# EasyEDA Pro project candlelight.eprj

# Schematic candelight
Create Date: 2022-07-31; Page Name: candelight; Project Name: candlelight; Schematic Name: candelight; Update Date: 2022-08-02
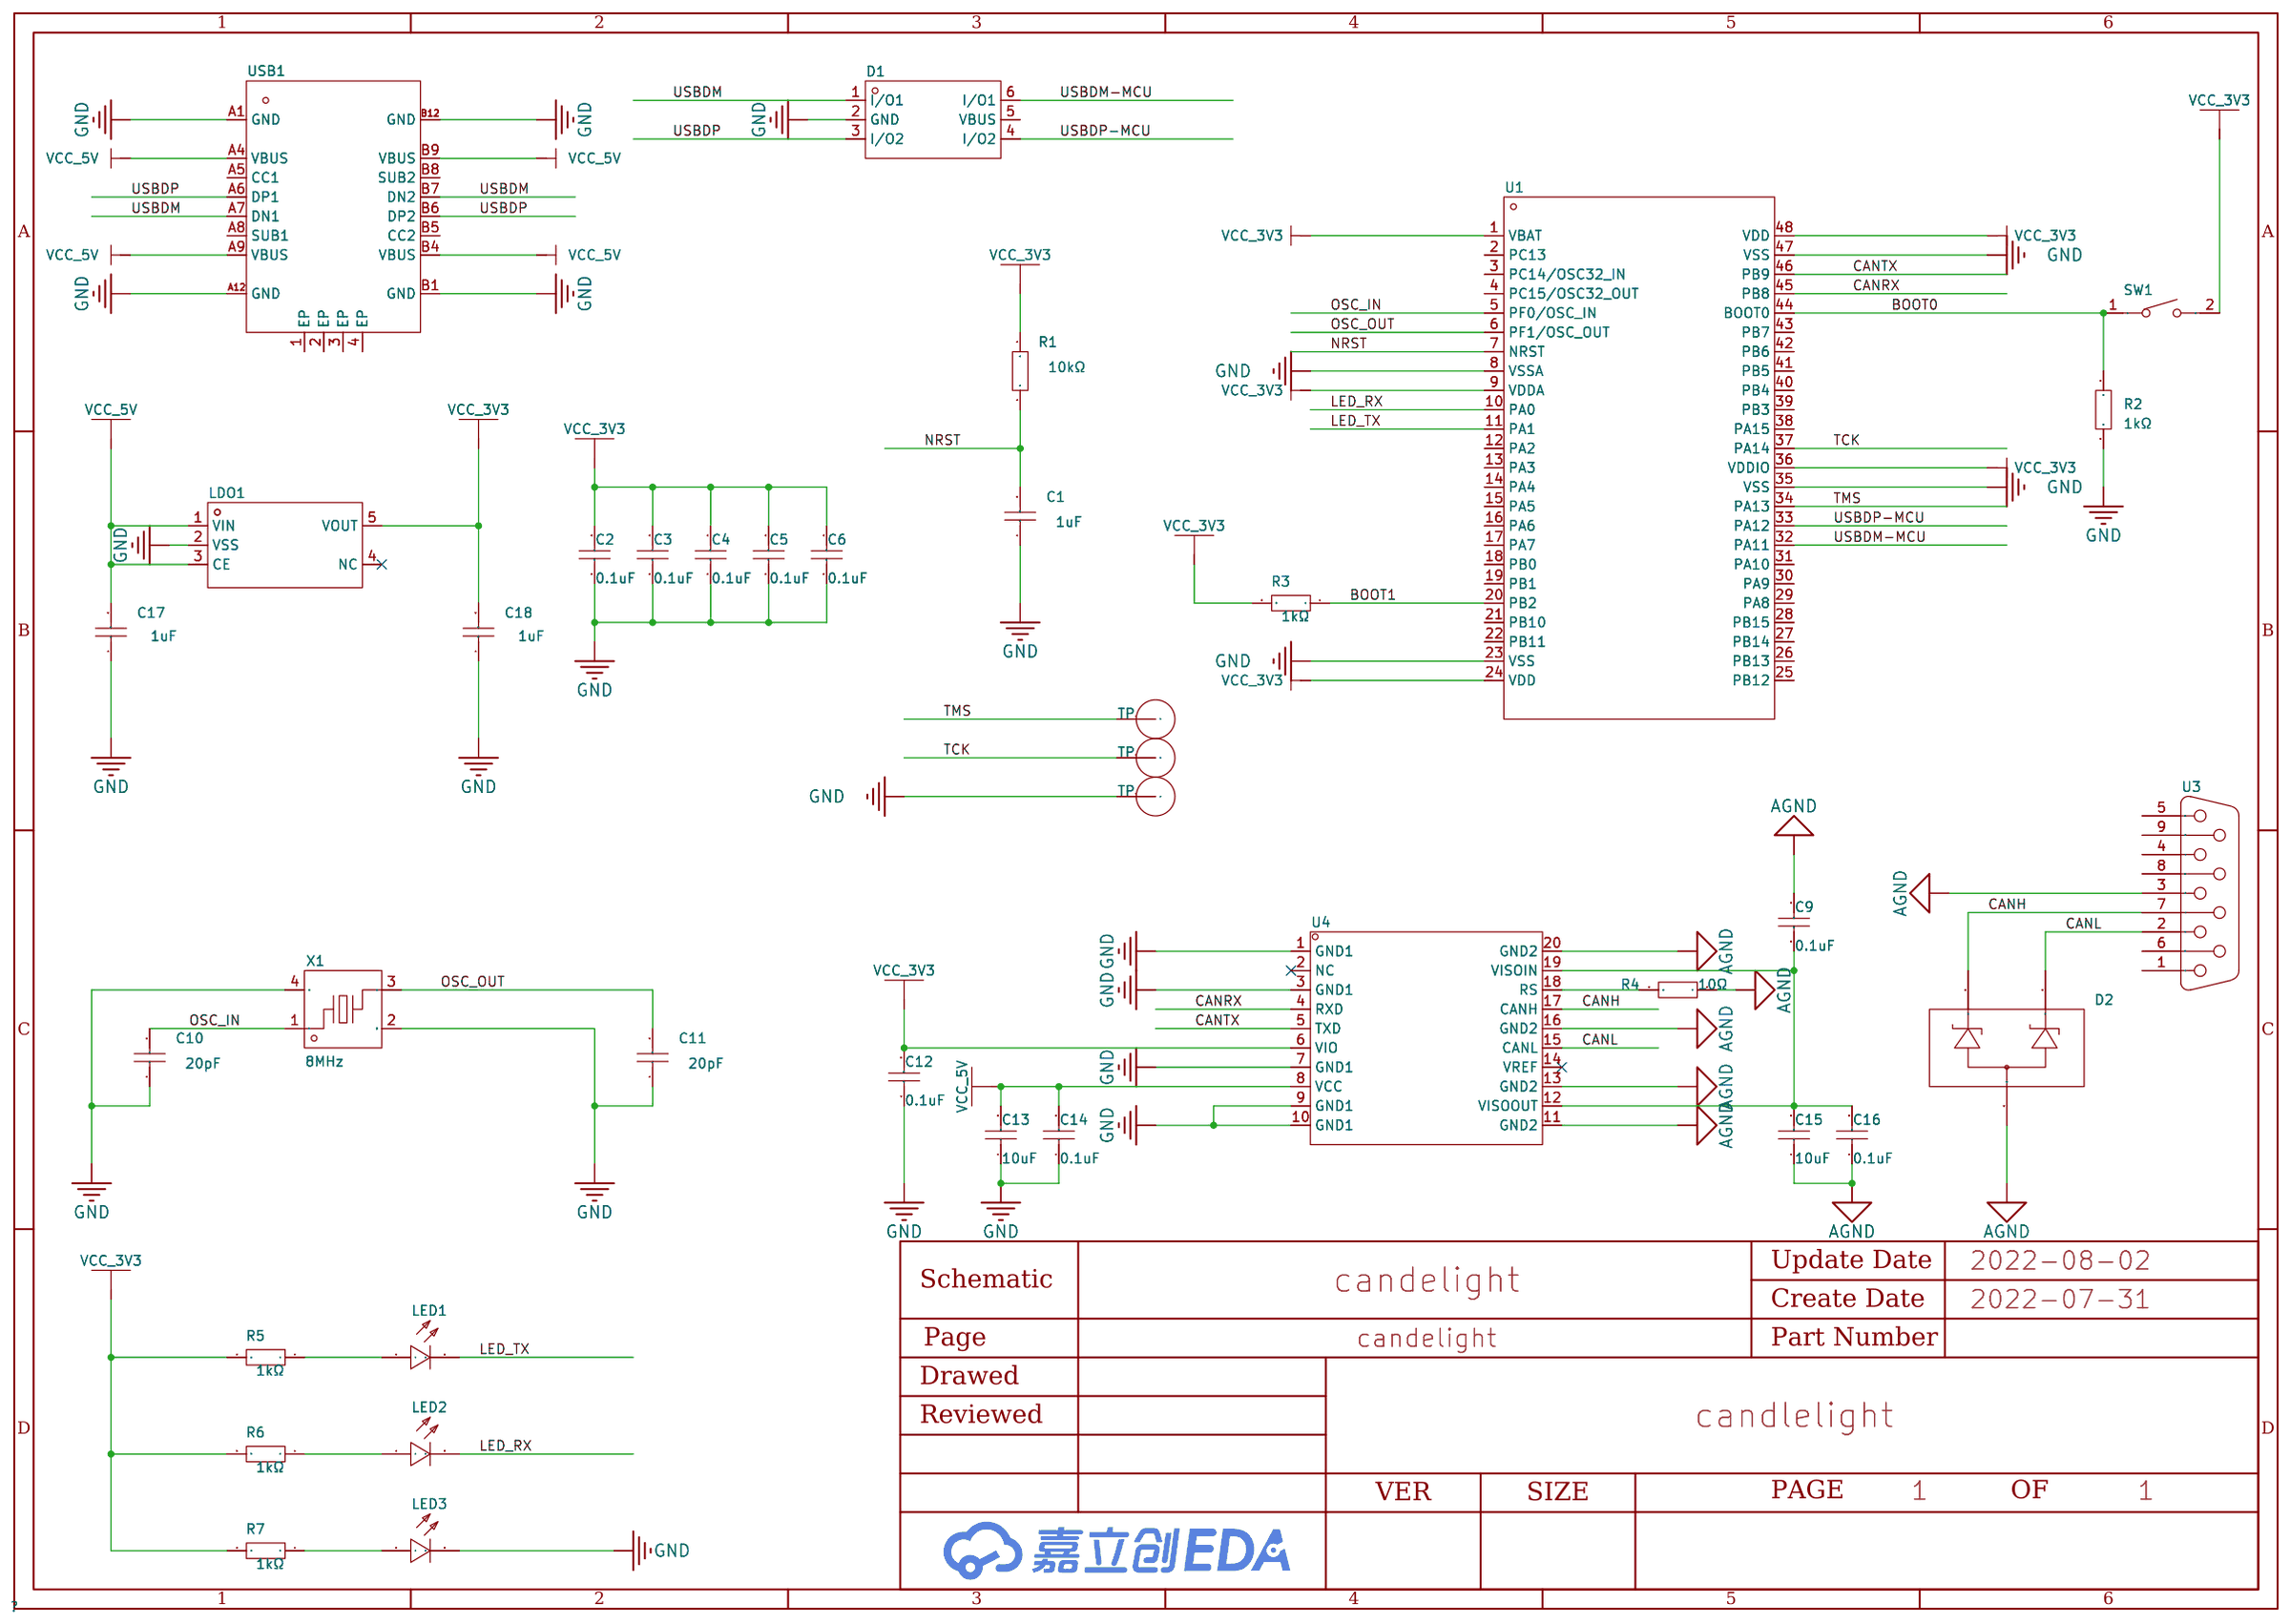
[diagram p0: schematic sheet]

## Parts
C1  1uF  [C0603]
C2  0.1uF  [C0603]
C3  0.1uF  [C0603]
C4  0.1uF  [C0603]
C5  0.1uF  [C0603]
C6  0.1uF  [C0603]
C9  0.1uF  [C0603]
C10  20pF  [C0603]
C11  20pF  [C0603]
C12  0.1uF  [C0603]
C13  10uF  [C0805]
C14  0.1uF  [C0603]
C15  10uF  [C0805]
C16  0.1uF  [C0603]
C17  1uF  [C0805]
C18  1uF  [C0805]
D1  -  [SOT-23-6_L2.9-W1.6-P0.95-LS2.8-BL]
D2  -  [SOT-23-3_L3.0-W1.7-P0.95-LS2.9-BR]
LDO1  -  [SOT-23-5_L3.0-W1.7-P0.95-LS2.8-BR]
LED1  -  [LED0603-FD]
LED2  -  [LED0603-FD]
LED3  -  [LED0603-FD]
R1  10kΩ  [R0603]
R2  1kΩ  [R0603]
R3  1kΩ  [R0603]
R4  10Ω  [R0603]
R5  1kΩ  [R0603]
R6  1kΩ  [R0603]
R7  1kΩ  [R0603]
SW1  -  [SW-SMD_L4.0-W2.9-LS5.0]
TP  -  [TP]
TP#2  -  [TP]
TP#3  -  [TP]
U1  -  [LQFP-48_L7.0-W7.0-P0.50-LS9.0-BL]
U3  -  [DB9_180C]
U4  -  [SOIC-20_L13.0-W7.6-P1.27-LS10.3-BL]
USB1  -  [USB-C-SMD_KH-TYPE-C-16P]
X1  8MHz  [OSC-SMD_4P-L3.2-W2.5-BL]

## Library data of the parts
C1-C6 C9-C12 C14 C16 = CL10C200JB8NNNC: 容值:20pF;精度:±5%;额定电压:50V;温度系数:C0G;; LCSC Part Name: 20pF ±5% 50V; Supplier Part: C1648; Manufacturer: SAMSUNG(三星); Supplier Footprint: 0603; JLCPCB Part Class: Basic Part; Datasheet: https://atta.szlcsc.com/upload/public/pdf/source/20160103/1457707686863.pdf; Supplier: LCSC; Tolerance: ±5%; Voltage Rated: 50V; Temperature Coefficient: C0G
C13 C15 = CL21A106KAYNNNE: 容值:10uF;精度:±10%;额定电压:25V;温度系数:X5R;; LCSC Part Name: 10uF ±10% 25V; Supplier Part: C15850; Manufacturer: SAMSUNG(三星); Supplier Footprint: 0805; JLCPCB Part Class: Basic Part; Datasheet: https://atta.szlcsc.com/upload/public/pdf/source/20160103/1457707679302.pdf; Supplier: LCSC; Tolerance: ±10%; Voltage Rated: 25V; Temperature Coefficient: X5R
C17 C18 = CL21B105KBFNNNE: 容值:1uF;精度:±10%;额定电压:50V;温度系数:X7R;; LCSC Part Name: 1uF ±10% 50V; Supplier Part: C28323; Manufacturer: SAMSUNG(三星); Supplier Footprint: 0805; JLCPCB Part Class: Basic Part; Datasheet: https://atta.szlcsc.com/upload/public/pdf/source/20160103/1457707718219.pdf; Supplier: LCSC; Tolerance: ±10%; Voltage Rated: 50V; Temperature Coefficient: X7R
D1 = USBLC6-2SC6: Supplier Part: C2687116; Manufacturer: UMW(友台半导体); Supplier Footprint: SOT23-6; JLCPCB Part Class: Extended Part; Datasheet: https://atta.szlcsc.com/upload/public/pdf/source/20210120/C2687116_72855D78BA38117EA699E100C421AF6D.pdf; Supplier: LCSC
D2 = ESDA6V1L: 反向截止电压(Vrwm):5.25V;击穿电压(最小值):6.1V;; LCSC Part Name: 5.25V; Supplier Part: C24378; Manufacturer: ST(意法半导体); Supplier Footprint: SOT-23(SOT-23-3); JLCPCB Part Class: Extended Part; Datasheet: https://atta.szlcsc.com/upload/public/pdf/source/20140512/1457707064919.pdf; Supplier: LCSC; Reverse Stand-Off Voltage (Vrwm): 5.25V; Breakdown Voltage (Min): 6.1V
LDO1 = ME6211C33M5G-N: 输出类型:固定;输出极性:正;输出通道数:1;最大输入电压:6V;输出电压:3.3V;压差:260mV@(200mA);输出电流:500mA;电源纹波抑制比(PRSS):70dB@(1kHz),62dB@(10kHz);; LCSC Part Name: Vin=6V Vout=3.3V 500mA 70dB@(1kHz),62dB@(10kHz); Supplier Part: C82942; Manufacturer: MICRONE(南京微盟); Supplier Footprint: SOT-23-5; JLCPCB Part Class: Extended Part; Datasheet: https://atta.szlcsc.com/upload/public/pdf/source/20170918/C82942_1505727073070976520.pdf; Supplier: LCSC; Output Type: 固定; Output Polarity: 正; Number of Outputs: 1; Maximum Input Voltage: 6V; Output Voltage: 3.3V; Dropout Voltage: 260mV@(200mA); Output Current: 500mA; Power Supply Rejection Ratio (PRSS): 70dB@(1kHz),62dB@(10kHz)
LED1-LED3 = NCD0603R1: 发光颜色:红灯;; LCSC Part Name: 红灯; Supplier Part: C84263; Manufacturer: 国星光电; Supplier Footprint: 0603; JLCPCB Part Class: Extended Part; Datasheet: https://atta.szlcsc.com/upload/public/pdf/source/20200820/C84263_DABC6A75E58F576973B407FDBA283D60.pdf; Supplier: LCSC; Emitted Color: 红灯
R1-R3 R5-R7 = 0603WAF1002T5E: 电阻类型:厚膜电阻;阻值:10kΩ;精度:±1%;功率:1/10W;温度系数:±100ppm/;最大工作电压:75V;工作温度范围:-55~+155;; LCSC Part Name: 10kΩ ±1%; Supplier Part: C25804; Manufacturer: UNI-ROYAL(厚声); Supplier Footprint: 0603; JLCPCB Part Class: Basic Part; Datasheet: https://atta.szlcsc.com/upload/public/pdf/source/20200306/C422600_1E6D84923E4A46A82E41ADD87F860B5C.pdf; Supplier: LCSC; Type: 厚膜电阻; Tolerance: ±1%; Power(Watts): 1/10W; Temperature Coefficient: ±100ppm/; Overload Voltage (Max): 75V; Operating Temperature Range: -55~+155
R4 = 0603WAF100JT5E: 电阻类型:厚膜电阻;阻值:10Ω;精度:±1%;功率:1/10W;温度系数:±400ppm/;最大工作电压:75V;工作温度范围:-55~+155;; LCSC Part Name: 10Ω ±1% 1/10W; Supplier Part: C22859; Manufacturer: UNI-ROYAL(厚声); Supplier Footprint: 0603; JLCPCB Part Class: Basic Part; Datasheet: https://atta.szlcsc.com/upload/public/pdf/source/20200306/C422600_1E6D84923E4A46A82E41ADD87F860B5C.pdf; Supplier: LCSC; Type: 厚膜电阻; Tolerance: ±1%; Power(Watts): 1/10W; Temperature Coefficient: ±400ppm/; Overload Voltage (Max): 75V; Operating Temperature Range: -55~+155
SW1 = TS-1088-AR02016: 触点电流:50mA;额定电压(DC):12V;绝缘电阻:100MΩ;电路结构:单刀单掷;安装方式:立贴;按钮形状:圆形按钮;按钮/盖帽颜色:黑色;作用力:160gf@±50gf;机械寿命:100000;工作温度:-30~+80;引脚样式:SMD接片;开关长度:4mm;开关宽度:3mm;开关高度:2mm;带支架:否;; LCSC Part Name: 342.0 160gf 贴片无柱轻触开关; Supplier Part: C720477; Manufacturer: XUNPU(讯普); Supplier Footprint: SMD; JLCPCB Part Class: Extended Part; Datasheet: https://atta.szlcsc.com/upload/public/pdf/source/20200810/C720475_60D09DD6C54279ADDB2DC25100F1CC11.pdf; Supplier: LCSC; Contact Current: 50mA; Voltage Rating (DC): 12V; Insulation Resistance: 100MΩ; Circuit: 单刀单掷; Mounting Style: 立贴; Actuator Style: 圆形按钮; Actuator/Cap Color: 黑色; Operating Force: 160gf@±50gf; Mechanical Life: 100000; Operating Temperature: -30~+80; Pin Style: SMD接片; Switch Length: 4mm; Switch Width: 3mm; Switch Height: 2mm; Strike Gundam: 否
TP TP#2 TP#3 = TP
U1 = STM32F072CBT6: CPU内核:ARM® Cortex®-M0;工作电压:1.65V ~ 3.6V;; Supplier Part: C81720; Manufacturer: ST(意法半导体); Supplier Footprint: LQFP-48_7x7x05P; JLCPCB Part Class: Extended Part; Datasheet: https://atta.szlcsc.com/upload/public/pdf/source/20170428/1493376825827.pdf; Supplier: LCSC; Core Processor: ARM® Cortex®-M0; Voltage - Supply (Vcc/Vdd): 1.65V ~ 3.6V; RAM Size: 16KB; Number of I/O: 37; A/D: 10x12bit; D/A: 2x12bit; PWM: 6; UART/USART: 4 USART; I2C（SMBUS/PMBUS）: 2; USB Device: 1; CAN: 1; Features: I2S,HDMI CEC
U3 = DB9_180C: DB9直插跨板
U4 = ADM3053BRWZ-REEL7: 类型:收发器;协议类别:CAN总线;驱动器/接收器数:1/1;数据速率:1Mbps;; Supplier Part: C117821; Manufacturer: ADI(亚德诺)/LINEAR; Supplier Footprint: SOIC-20_300mil; JLCPCB Part Class: Extended Part; Datasheet: https://atta.szlcsc.com/upload/public/pdf/source/20170707/1499421567880.pdf; Supplier: LCSC; Type: 收发器; Protocol: CAN总线; Number of Drivers/Receivers: 1/1; Data Rate: 1Mbps; Supply Voltage: 3.3V, 5V
USB1 = KH-TYPE-C-16P: 连接器类型:Type-C;标准:-;公母:母座;触点数量:16;端口数量:1;安装方式:卧贴;额定电流 - 电源:3A;工作温度范围:-40~+85;; LCSC Part Name: Type-C 母座 卧贴; Supplier Part: C709357; Manufacturer: kinghelm(金航标); Supplier Footprint: SMD; JLCPCB Part Class: Extended Part; Datasheet: https://atta.szlcsc.com/upload/public/pdf/source/20200911/C709357_AA8DCEB38BB20E3035A7ED7AE7667837.pdf; Supplier: LCSC; Connector Type: Type-C; Gender: 母座; Number of Contacts: 16; Number of Ports: 1; Mounting Style: 卧贴; Current Rating - Power (Max): 3A; Operating Temperature Range: -40~+85
X1 = X32258MOB4SI: 晶振类型:贴片无源晶振;频率:8MHz;频率公差:±10ppm;频率稳定度:±30ppm;负载电容:12pF;工作温度:-40~+85;; LCSC Part Name: YSX321SL 8MHz 12pF ±10ppm; Supplier Part: C2682775; Manufacturer: YXC扬兴科技; Supplier Footprint: SMD3225-4P; JLCPCB Part Class: Extended Part; Datasheet: https://atta.szlcsc.com/upload/public/pdf/source/20210106/C2682774_0CD4FDA5D9DA3FBEEC23BD607A48E4B0.pdf; Supplier: LCSC; Crystal Type: 贴片无源晶振; Frequency Tolerance: ±10ppm; Frequency Stability: ±30ppm; Load Capacitance: 12pF; Operating Temperature: -40~+85

## Nets
AGND: C9.2 C15.1 C16.1 D2.3 R4.1 U3.3 U4.11(GND2) U4.13(GND2) U4.16(GND2) U4.20(GND2)
GND: C1.1 C2.1 C3.1 C4.1 C5.1 C6.1 C10.1 C11.1 C12.1 C13.1 C14.1 C17.1 C18.1 D1.2(GND) LDO1.2(VSS) LED3.2(K) R2.2 TP#3.1 U1.8(VSSA) U1.23(VSS) U1.35(VSS) U1.47(VSS) U4.1(GND1) U4.3(GND1) U4.7(GND1) U4.9(GND1) U4.10(GND1) USB1.A1(GND) USB1.A12(GND) USB1.B1(GND) USB1.B12(GND) X1.2(GND) X1.4(GND)
VCC_3V3: C2.2 C3.2 C4.2 C5.2 C6.2 C12.2 C18.2 LDO1.5(VOUT) R1.2 R3.2 R5.2 R6.2 R7.2 SW1.2 U1.1(VBAT) U1.9(VDDA) U1.24(VDD) U1.36(VDDIO) U1.48(VDD) U4.6(VIO)
VCC_5V: C13.2 C14.2 C17.2 LDO1.1(VIN) LDO1.3(CE) U4.8(VCC) USB1.A4(VBUS) USB1.A9(VBUS) USB1.B4(VBUS) USB1.B9(VBUS)
BOOT0: R2.1 SW1.1 U1.44(BOOT0)
BOOT1: R3.1 U1.20(PB2)
CANH: D2.2 U3.7 U4.17(CANH)
CANL: D2.1 U3.2 U4.15(CANL)
CANRX: U1.45(PB8) U4.4(RXD)
CANTX: U1.46(PB9) U4.5(TXD)
LED_RX: LED2.2(K) U1.10(PA0)
LED_TX: LED1.2(K) U1.11(PA1)
NRST: C1.2 R1.1 U1.7(NRST)
OSC_IN: C10.2 U1.5(PF0/OSC_IN) X1.1
OSC_OUT: C11.2 U1.6(PF1/OSC_OUT) X1.3
TCK: TP.1 U1.37(PA14)
TMS: TP#2.1 U1.34(PA13)
USBDM: D1.1(I/O1) USB1.A7(DN1) USB1.B7(DN2)
USBDM-MCU: D1.6(I/O1) U1.32(PA11)
USBDP: D1.3(I/O2) USB1.A6(DP1) USB1.B6(DP2)
USBDP-MCU: D1.4(I/O2) U1.33(PA12)
$1N12268: R4.2 U4.18(RS)
$1N12385: C9.1 C15.2 C16.2 U4.12(VISOOUT) U4.19(VISOIN)
Net-(LED1-1): LED1.1(A) R5.1
Net-(LED2-1): LED2.1(A) R6.1
Net-(LED3-1): LED3.1(A) R7.1

Not connected (* = marked no-connect by the designer): D1 5(VBUS); LDO1 4(NC)*; U1 2(PC13) 3(PC14/OSC32_IN) 4(PC15/OSC32_OUT) 12(PA2) 13(PA3) 14(PA4) 15(PA5) 16(PA6) 17(PA7) 18(PB0) 19(PB1) 21(PB10) 22(PB11) 25(PB12) 26(PB13) 27(PB14) 28(PB15) 29(PA8) 30(PA9) 31(PA10) 38(PA15) 39(PB3) 40(PB4) 41(PB5) 42(PB6) 43(PB7); U3 1 4 5 6 8 9; U4 2(NC)* 14(VREF)*; USB1 1(EP) 2(EP) 3(EP) 4(EP) A5(CC1) A8(SUB1) B5(CC2) B8(SUB2)

# Board candelight
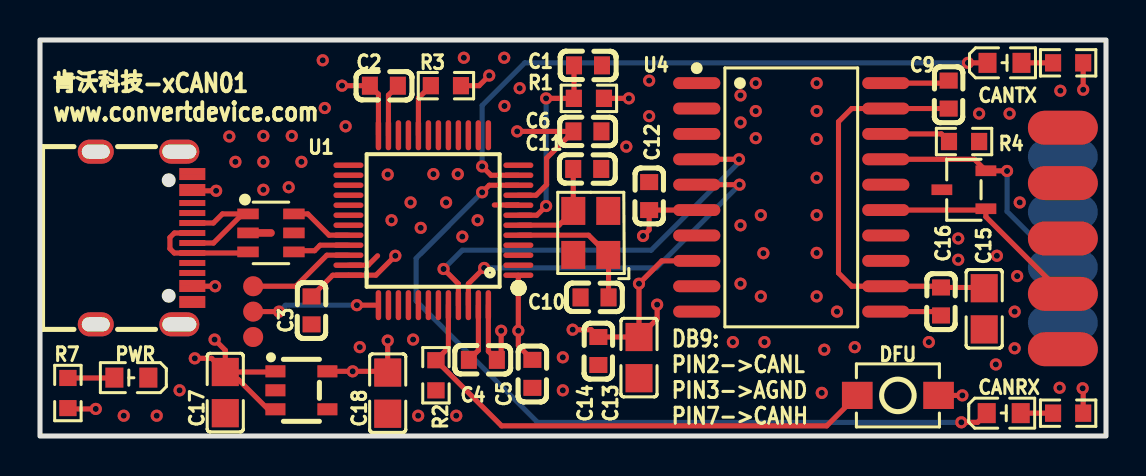
[diagram p1: board, top side]
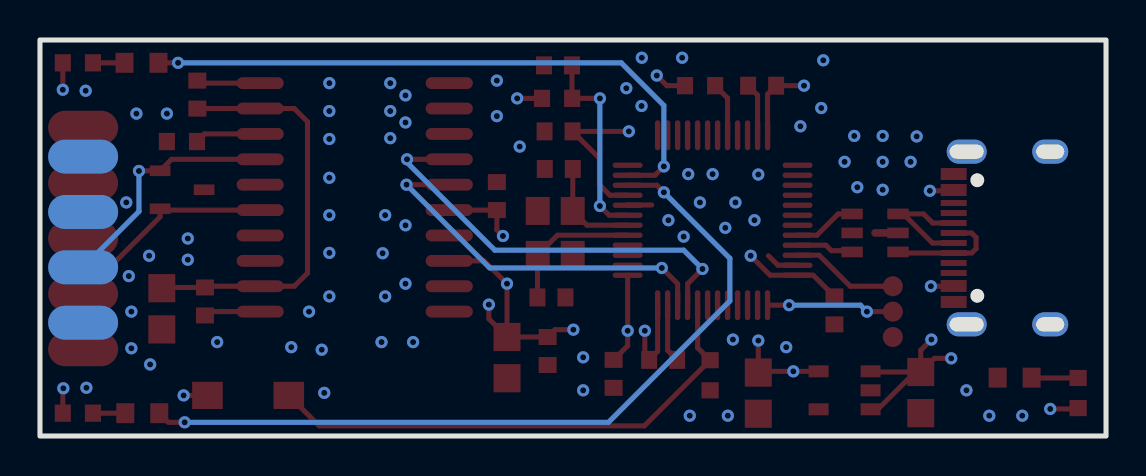
[diagram p2: board, bottom side, seen from below]

Outline 53.34 x 19.81 mm; copper layers: Top Layer, GND, POWER, Bottom Layer. Coordinates in mm from the lower left corner of the outline.
Outline path: rectangle 0,19.81 53.34,0
Stack: Top Layer 0.035mm / Dielectric1 0.48mm PP er 4.5 / GND 0.035mm / Dielectric2 0.48mm FR4 er 4.5 / POWER 0.035mm / Dielectric3 0.48mm PP er 4.5 / Bottom Layer 0.035mm

## Design rules (mm)
spacing safeClearance (default): track to track 0.152, other pairs 0.152 to 0.3
track width trackWidth (default): min 0.127, default 0.254, max 2.54
differential pair differentialPair (default): width min 0.127, default 0.254, max 2.54; gap min 0.152, default 0.152
via viaSize (default): diameter min 0.5, default 0.61, max 10; hole min 0.3, default 0.305, max 6

## Placement (name value [footprint] x y rotation side)
C1  1uF  [C0603]  27.42 18.54 180 top
C2  0.1uF  [C0603]  17.21 17.53 180 top
C3  0.1uF  [C0603]  13.59 6.29 90 top
C4  0.1uF  [C0603]  22.16 3.81 0 top
C5  0.1uF  [C0603]  24.64 3.11 90 top
C6  0.1uF  [C0603]  27.39 15.24 180 top
C9  0.1uF  [C0603]  45.47 17.08 90 top
C10  20pF  [C0603]  27.75 6.93 0 top
C11  20pF  [C0603]  27.38 13.36 180 top
C12  0.1uF  [C0603]  30.48 12 270 top
C13  10uF  [C0805]  29.97 3.92 90 top
C14  0.1uF  [C0603]  27.94 4.25 90 top
C15  10uF  [C0805]  47.24 6.36 90 top
C16  0.1uF  [C0603]  45.09 6.73 90 top
C17  1uF  [C0805]  9.27 2.17 90 top
C18  1uF  [C0805]  17.4 2.15 90 top
CANRX  -  [LED0603-FD]  48.22 1.14 180 top
CANTX  -  [LED0603-FD]  48.26 18.67 180 top
D1  -  [SOT-23-6_L2.9-W1.6-P0.95-LS2.8-BL]  11.56 10.16 270 top
D2  -  [SOT-23-3_L3.0-W1.7-P0.95-LS2.9-BR]  46.23 12.32 0 top
DFU  -  [SW-SMD_L4.0-W2.9-LS5.0]  42.93 2.03 0 top
LDO1  -  [SOT-23-5_L3.0-W1.7-P0.95-LS2.8-BR]  13.08 2.29 180 top
PWR  -  [LED0603-FD]  4.57 2.92 0 top
R1  10kΩ  [R0603]  27.47 16.89 0 top
R2  1kΩ  [R0603]  19.81 3.04 270 top
R3  1kΩ  [R0603]  20.31 17.53 0 top
R4  10Ω  [R0603]  46.24 14.73 180 top
R5  1kΩ  [R0603]  51.44 18.67 0 top
R6  1kΩ  [R0603]  51.44 1.14 0 top
R7  1kΩ  [R0603]  1.4 2.15 270 top
TP  -  [TP]  10.67 6.22 0 top
TP#2  -  [TP]  10.67 7.49 0 top
TP#3  -  [TP]  10.67 4.95 0 top
U1  -  [LQFP-48_L7.0-W7.0-P0.50-LS9.0-BL]  19.69 10.8 90 top
U3  -  [DB9_180C]  51.18 4.34 0 top
U4  -  [SOIC-20_L13.0-W7.6-P1.27-LS10.3-BL]  37.59 11.94 270 top
USB1  -  [USB-C-SMD_KH-TYPE-C-16P]  5.21 9.91 270 top
X1  8MHz  [OSC-SMD_4P-L3.2-W2.5-BL]  27.56 10.16 90 top

## Footprints (pads in the part's own frame, mm; a bottom-side part is the same pattern mirrored in y, then rotated)
C0603
  rect 0.8x0.9 smd: 1(-0.7,0) 2(0.7,0)
C0805
  rect 1.41x1.35 smd: 1(-1.03,0) 2(1.03,0)
DB9_180C
  oval 3.5x1.7 smd: 1(0,0) 2(0,2.77) 3(0,5.54) 4(0,8.31) 5(0,11.08)
  oval 3.5x1.7 smd far side: 6(0,1.327) 7(0,4.096) 8(0,6.867) 9(0,9.636)
LED0603-FD
  rect 0.9x1 smd: 1(-0.85,0) 2(0.85,0)
LQFP-48_L7.0-W7.0-P0.50-LS9.0-BL
  oval 0.27x1.5 smd: 1(-2.75,-4.25) 2(-2.25,-4.25) 3(-1.75,-4.25) 4(-1.25,-4.25) 5(-0.75,-4.25) 6(-0.25,-4.25) 7(0.25,-4.25) 8(0.75,-4.25) 9(1.25,-4.25) 10(1.75,-4.25) 11(2.25,-4.25) 12(2.75,-4.25) 25(2.75,4.25) 26(2.25,4.25) 27(1.75,4.25) 28(1.25,4.25) 29(0.75,4.25) 30(0.25,4.25) 31(-0.25,4.25) 32(-0.75,4.25) 33(-1.25,4.25) 34(-1.75,4.25) 35(-2.25,4.25) 36(-2.75,4.25)
  oval 1.5x0.27 smd: 13(4.25,-2.75) 14(4.25,-2.25) 15(4.25,-1.75) 16(4.25,-1.25) 17(4.25,-0.75) 18(4.25,-0.25) 19(4.25,0.25) 20(4.25,0.75) 21(4.25,1.25) 22(4.25,1.75) 23(4.25,2.25) 24(4.25,2.75) 37(-4.25,2.75) 38(-4.25,2.25) 39(-4.25,1.75) 40(-4.25,1.25) 41(-4.25,0.75) 42(-4.25,0.25) 43(-4.25,-0.25) 44(-4.25,-0.75) 45(-4.25,-1.25) 46(-4.25,-1.75) 47(-4.25,-2.25) 48(-4.25,-2.75)
OSC-SMD_4P-L3.2-W2.5-BL
  rect 1.4x1.2 smd: 1(-1.1,-0.875) 2(1.1,-0.875) 3(1.1,0.875) 4(-1.1,0.875)
R0603
  rect 0.806x0.864 smd: 1(-0.753,0) 2(0.753,0)
SOIC-20_L13.0-W7.6-P1.27-LS10.3-BL
  oval 0.595x2.36 smd: 1(-5.715,-4.73) 2(-4.445,-4.73) 3(-3.175,-4.73) 4(-1.905,-4.73) 5(-0.635,-4.73) 6(0.635,-4.73) 7(1.905,-4.73) 8(3.175,-4.73) 9(4.445,-4.73) 10(5.715,-4.73) 11(5.715,4.73) 12(4.445,4.73) 13(3.175,4.73) 14(1.905,4.73) 15(0.635,4.73) 16(-0.635,4.73) 17(-1.905,4.73) 18(-3.175,4.73) 19(-4.445,4.73) 20(-5.715,4.73)
SOT-23-3_L3.0-W1.7-P0.95-LS2.9-BR
  rect 1.038x0.532 smd: 1(1.101,-0.95) 2(1.101,0.95) 3(-1.101,0)
SOT-23-5_L3.0-W1.7-P0.95-LS2.8-BR
  rect 1x0.6 smd: 1(1.3,-0.95) 2(1.3,0) 3(1.3,0.95) 4(-1.3,0.95) 5(-1.3,-0.95)
SOT-23-6_L2.9-W1.6-P0.95-LS2.8-BL
  rect 0.532x1.072 smd: 1(-0.95,-1.149) 2(0,-1.149) 3(0.95,-1.149) 4(0.95,1.149) 5(0,1.149) 6(-0.95,1.149)
SW-SMD_L4.0-W2.9-LS5.0
  rect 1.53x1.36 smd: 1(-2.035,0) 2(2.035,0)
TP
  round 1 smd: 1(0,0)
USB-C-SMD_KH-TYPE-C-16P
  oval 1.2x2 hole 0.7x1.7: 1(-4.32,1.765) 2(4.32,1.765)
  oval 1.2x1.8 hole 0.7x1.4: 3(-4.32,-2.415) 4(4.32,-2.415)
  rect 0.3x1.3 smd: A1(-3.35,2.415) A4(-2.55,2.415) A5(-1.25,2.415) A6(-0.25,2.415) A7(0.25,2.415) A8(1.25,2.415) A9(2.55,2.415) A12(3.35,2.415) B1(3.05,2.415) B4(2.25,2.415) B5(1.75,2.415) B6(0.75,2.415) B7(-0.75,2.415) B8(-1.75,2.415) B9(-2.25,2.415) B12(-3.05,2.415)

## Nets
AGND: C9.2 C15.1 C16.1 D2.3 R4.1 U3.3 U4.11 U4.13 U4.16 U4.20
GND: C1.1 C2.1 C3.1 C4.1 C5.1 C6.1 C10.1 C11.1 C12.1 C13.1 C14.1 C17.1 C18.1 D1.2 LDO1.2 PWR.2 R2.2 TP#3.1 U1.8 U1.23 U1.35 U1.47 U4.1 U4.3 U4.7 U4.9 U4.10 USB1.A1 USB1.A12 USB1.B1 USB1.B12 X1.2 X1.4
VCC_3V3: C2.2 C3.2 C4.2 C5.2 C6.2 C12.2 C18.2 DFU.2 LDO1.5 R1.2 R3.2 R5.2 R6.2 R7.2 U1.1 U1.9 U1.24 U1.36 U1.48 U4.6
VCC_5V: C13.2 C14.2 C17.2 LDO1.1 LDO1.3 U4.8 USB1.A4 USB1.A9 USB1.B4 USB1.B9
BOOT0: DFU.1 R2.1 U1.44
BOOT1: R3.1 U1.20
CANH: D2.2 U3.7 U4.17
CANL: D2.1 U3.2 U4.15
CANRX: U1.45 U4.4
CANTX: U1.46 U4.5
LED_RX: CANRX.2 U1.10
LED_TX: CANTX.2 U1.11
NRST: C1.2 R1.1 U1.7
OSC_IN: C10.2 U1.5 X1.1
OSC_OUT: C11.2 U1.6 X1.3
TCK: TP.1 U1.37
TMS: TP#2.1 U1.34
USBDM: D1.1 USB1.A7 USB1.B7
USBDM-MCU: D1.6 U1.32
USBDP: D1.3 USB1.A6 USB1.B6
USBDP-MCU: D1.4 U1.33
$1N4542: CANTX.1 R5.1
$1N4557: CANRX.1 R6.1
$1N4572: PWR.1 R7.1
$1N12268: R4.2 U4.18
$1N12385: C9.1 C15.2 C16.2 U4.12 U4.19

Pads without a net: D1 5; LDO1 4; U1 2 3 4 12 13 14 15 16 17 18 19 21 22 25 26 27 28 29 30 31 38 39 40 41 42 43; U3 1 4 5 6 8 9; U4 2 14; USB1 1 2 3 4 A5 A8 B5 B8

## Via types
v1: diameter 0.61, hole 0.305, Top Layer to Bottom Layer, 106 vias

## Routing (per net, layer and track width the routed paths; a pad name or vN(x,y) marks a point on that pad's centre or on a via; arc(x,y) is an arc through that point)
AGND: length 6
  Top Layer w0.254: C16.1 44.89,6.22 U4.11 ; U4.20 45.34,17.65 C9.2
  vias: v1(38.86,17.65) v1(38.86,16.26) v1(38.86,14.86) v1(38.86,12.92) v1(38.86,11.05) v1(38.86,9.16) v1(38.86,6.98) v1(39.12,2.16) v1(39.24,4.32) v1(39.88,6.22) v1(40.77,4.45) v1(44.48,4.7) v1(45.94,9.88) v1(45.94,8.82) v1(46.99,16.13) v1(47.83,3.58) v1(47.88,9.02) v1(48.51,16.13) v1(48.77,6.22) v1(48.77,4.39) v1(48.9,8) v1(49.02,11.68) v1(51.02,2.41) v1(51.05,17.27)
GND: length 9.6
  Top Layer w0.254: U1.8 23.92,11.56 22.73,11.56 ; U1.35 16.42,8.55 16.89,9.02 ; U1.23 17.44,17.05 17.91,17.53 ; C4.1 21.94,4.29 U1.47
  Top Layer w0.381: D1.2 11.56,10.16
  vias: v1(4.19,1.02) v1(5.84,1.02) v1(6.98,2.29) v1(9.47,14.99) v1(9.78,13.72) v1(11.18,15.01) v1(11.18,13.72) v1(11.18,12.32) v1(12.45,12.45) v1(12.6,15.01) v1(13.08,13.72) v1(14.15,18.8) v1(14.25,16.41) v1(15.29,15.49) v1(16,4.45) v1(17.4,13.08) v1(17.59,10.8) v1(18.54,11.68) v1(18.67,4.83) v1(18.92,1.02) v1(19.05,10.41) v1(19.69,13.1) v1(20.32,11.68) v1(20.83,1.02) v1(20.91,13.1) v1(21.13,9.97) v1(21.21,18.92) v1(21.9,10.8) v1(23.23,18.92) v1(23.24,16.51) v1(24,17.4) v1(26.16,3.94) v1(26.16,2.29) v1(29.34,14.48) v1(30.48,17.78) v1(30.48,16) v1(34.67,4.7) v1(35.05,17.04) v1(35.05,15.69) v1(35.05,10.54) v1(35.05,7.62) v1(35.81,17.65) v1(35.81,16.26) v1(35.81,14.9) v1(36.07,11.05) v1(36.07,6.98) v1(36.19,9.14) v1(36.25,4.7)
VCC_3V3: length 42.3
  Top Layer w0.254: v1(17.4,4.78) C18.2 17.34,3.24 v1(15.65,3.24) LDO1.5 ; U1.24 16.94,17.1 C2.2 v1(15.11,17.53) ; R7.2 1.44,1.36 v1(2.79,1.36) ; R3.2 21.97,17.53 v1(22.48,18.03) ; C3.2 14.65,8.05 U1.36 16.81,8.05 v1(17.78,9.02) ; R5.2 v1(52.2,17.32) ; v1(23.08,5.27) 23.08,4.03 C4.2 22.44,4.23 U1.48 ; v1(52.17,2.39) 52.2,2.36 R6.2 ; v1(29.46,16.89) R1.2 ; DFU.2 v1(46.15,2.03) ; U1.1 v1(23.94,5.27) 23.94,4.51 C5.2 ; v1(30.18,10.01) 30.48,10.31 C12.2 U4.6 ; v1(23.88,15.24) C6.2 25.35,13.9 25.35,12.57 24.82,12.05 U1.9
VCC_5V: length 24
  Top Layer w0.254: C13.2 v1(29.97,7.62) 31.12,8.76 U4.8 ; C13.2 30.88,5.86 v1(30.88,6.57) ; C13.2 C14.2 27.57,5.32 v1(26.65,5.32) ; C17.2 8.59,3.89 v1(7.75,3.89) ; C17.2 9.27,4.29 v1(8.74,4.83) ; C17.2 11.75,3.2 LDO1.1 ; C17.2 9.65,2.82 9.93,2.82 11.41,1.34 LDO1.3 ; v1(8.76,7.49) 7.76,7.49 USB1.A9 USB1.B4 ; v1(8.81,12.27) 7.73,12.27 USB1.B9 USB1.A4
BOOT0: length 26.1
  Top Layer w0.254: DFU.1 39.37,0.51 23.1,0.51 19.81,3.79 20.44,4.42 U1.44
BOOT1: length 2.7
  Top Layer w0.254: R3.1 18.94,16.9 U1.20
CANH: length 12.3
  Top Layer w0.254: U4.17 46.76,13.84 D2.2 48.38,13.27 v1(48.39,13.26)
  Bottom Layer w0.254: U3.7 48.39,11.23 v1(48.39,13.26)
CANL: length 10.9
  Top Layer w0.254: U4.15 47.26,11.3 D2.1 47.33,10.96 U3.2
CANRX: length 21.4
  Top Layer w0.254: U1.45 20.94,7.61 v1(20.19,8.36) ; U4.4 v1(34.98,13.84)
  Bottom Layer w0.254: v1(20.19,8.36) 21.13,9.3 30.58,9.3 34.98,13.69 v1(34.98,13.84)
CANTX: length 18.8
  Top Layer w0.254: v1(22.22,8.41) 21.44,7.62 U1.46 ; U4.5 v1(35,12.57)
  Bottom Layer w0.254: v1(22.22,8.41) 30.84,8.41 v1(35,12.57)
LED_RX: length 40
  Top Layer w0.254: v1(22.12,12.19) 22.48,12.55 U1.10 ; v1(46.1,0.69) 46.91,0.69 CANRX.2
  Bottom Layer w0.254: v1(46.1,0.69) 24.89,0.69 18.82,6.76 18.82,8.89 v1(22.12,12.19)
LED_TX: length 31.2
  Top Layer w0.254: U1.11 22.57,13.05 v1(22.12,13.49) ; CANTX.2 v1(46.43,18.67)
  Bottom Layer w0.254: v1(46.43,18.67) 24.26,18.67 22.12,16.54 v1(22.12,13.49)
NRST: length 10
  Top Layer w0.254: v1(25.32,11.51) 24.86,11.05 U1.7 ; v1(25.32,16.89) R1.1 26.72,16.9 C1.2
  Bottom Layer w0.254: v1(25.32,16.89) v1(25.32,11.51)
OSC_IN: length 7
  Top Layer w0.254: C10.2 28.45,9.05 27.45,10.05 U1.5
OSC_OUT: length 5.1
  Top Layer w0.254: U1.6 25.97,10.55 X1.3 26.68,11.26 C11.2
TCK: length 6.4
  Top Layer w0.254: 15.85,6.55 v1(15.86,6.55) U1.37 ; v1(11.96,6.22) TP.1
  Bottom Layer w0.254: v1(11.96,6.22) 12.29,6.55 v1(15.86,6.55)
TMS: length 5.4
  Top Layer w0.254: TP#2.1 12.8,7.49 14.35,9.05 U1.34
USBDM: length 6.1
  Top Layer w0.254: 10.14,11.11 9.13,11.11 8.68,10.66 USB1.B7 ; 10.14,11.11 D1.1 ; 10.14,11.11 8.68,9.66 USB1.A7
USBDM-MCU: length 3.2
  Top Layer w0.254: U1.32 14.47,10.05 13.4,11.11 D1.6
USBDP: length 5.8
  Top Layer w0.254: D1.3 10.35,9.16 USB1.B6 6.72,9.16 6.5,9.37 6.5,9.93 6.73,10.16 USB1.A6
USBDP-MCU: length 2.9
  Top Layer w0.254: D1.4 12.77,9.27 13.74,9.27 14.02,9.55 U1.33
$1N4542: length 1.6
  Top Layer w0.254: R5.1 CANTX.1
$1N4557: length 1.6
  Top Layer w0.254: CANRX.1 R6.1
$1N4572: length 2.3
  Top Layer w0.254: PWR.1 3.7,2.9 R7.1
$1N12268: length 3.3
  Top Layer w0.254: R4.2 45.1,15.11 U4.18
$1N12385: length 21
  Top Layer w0.254: C15.2 47.21,7.43 C16.2 45.02,7.49 40.61,7.49 39.95,8.15 39.95,15.72 40.61,16.38 U4.19 45.46,16.38 C9.1

## Copper pours and planes (outline as drawn; the poured copper is in the pictures)
AGND on Top Layer: 38.35,19.81 53.34,19.81 53.34,0 38.35,0
AGND on Bottom Layer: 38.35,19.81 53.34,19.81 53.34,0 38.35,0
GND on Top Layer: 0,19.81 36.93,19.81 36.93,0 0,0
GND on Bottom Layer: 0,19.81 36.96,19.81 36.96,0 0,0
GND on GND: 0.26,19.56 53.08,19.56 53.08,0.26 0.26,0.26
VCC_3V3 on POWER: 0.26,19.56 53.08,19.56 53.08,0.26 0.26,0.26
VCC_5V on POWER: 0.26,12.7 34.14,12.7 34.14,2.57 0.26,2.57

## Text on the board
Top Silkscreen Layer: DB9: / PIN2->CANL / PIN3->AGND / PIN7->CANH | 肯沃科技-xCAN01 / www.convertdevice.com
